# Altium schematic sheet Sheet1.SchDoc
size A4; SheetNumber: 2; SheetTotal: 2
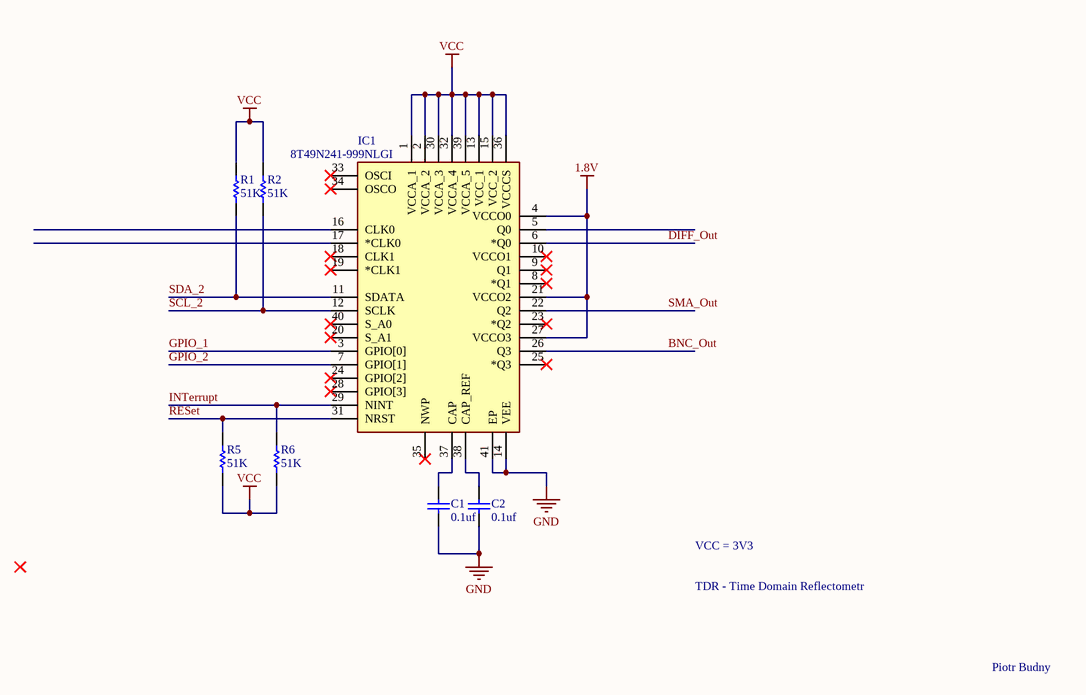
[diagram p0: Sheet1.SchDoc]

## Parts
C1  value 0.1uf  (hidden comment: Capacitor)
C2  value 0.1uf  (hidden comment: Capacitor)
IC1  8T49N241-999NLGI  [QFN50P600X600X100-41N]
R1  value 51K  (hidden comment: Resistor)
R2  value 51K  (hidden comment: Resistor)
R5  value 51K  (hidden comment: Resistor)
R6  value 51K  (hidden comment: Resistor)

## Nets
1.8V: IC1.4(VCCO0) IC1.21(VCCO2) IC1.27(VCCO3)
GND: C1.2 C2.1 IC1.14(VEE) IC1.41(EP)
VCC: IC1.1(VCCA_1) IC1.2(VCCA_2) IC1.13(VCC_1) IC1.15(VCC_2) IC1.30(VCCA_3) IC1.32(VCCA_4) IC1.36(VCCCS) IC1.39(VCCA_5) R1.2 R2.2 R5.1 R6.1
BNC_Out: IC1.26(Q3)
DIFF_Out: IC1.6(*Q0)
GPIO_1: IC1.3(GPIO[0])
GPIO_2: IC1.7(GPIO[1])
INTerrupt: IC1.29(NINT) R6.2
RESet: IC1.31(NRST) R5.2
SCL_2: IC1.12(SCLK) R2.1
SDA_2: IC1.11(SDATA) R1.1
SMA_Out: IC1.22(Q2)
NetC1_1: C1.1 IC1.37(CAP)
NetC2_2: C2.2 IC1.38(CAP_REF)

Not connected (* = marked no-connect by the designer): IC1 5(Q0) 8(*Q1)* 9(Q1)* 10(VCCO1)* 16(CLK0) 17(*CLK0) 18(CLK1)* 19(*CLK1)* 20(S_A1)* 23(*Q2)* 24(GPIO[2])* 25(*Q3)* 28(GPIO[3])* 33(OSCI)* 34(OSCO)* 35(NWP)* 40(S_A0)*

## Notes on the sheet
- TDR - Time Domain Reflectometr
- VCC = 3V3
- Piotr Budny

## Library data of the parts
C1 C2 = Capacitor: SimulationGenericComponent: True
IC1 = 8T49N241-999NLGI: Integrated Circuit; Manufacturer_Name: Renesas Electronics; Datasheet Link: https://www.idt.com/document/dst/8t49n241-datasheet; Height: 1mm; Manufacturer_Part_Number: 8T49N241-999NLGI; Mouser Part Number: 972-8T49N241-999NLGI; Mouser Price/Stock: https://www.mouser.co.uk/ProductDetail/Renesas-Electronics/8T49N241-999NLGI?qs=ZwKJWZfDtNjnVZ7GQAcPpQ%3D%3D
R1 R2 R5 R6 = Resistor: TC1: 0; SimulationGenericComponent: True; TC2: 0